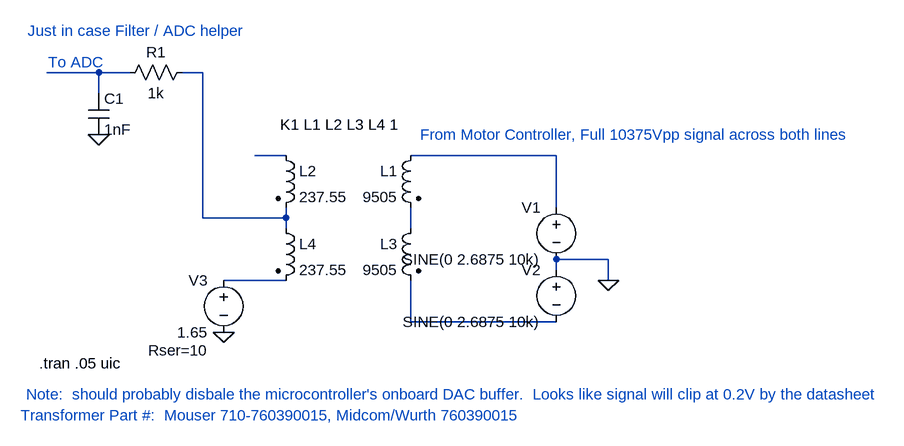
[diagram p0: schematic Input sensing circuit.asc]
Input sensing circuit.asc, the LTspice schematic file:
Version 4
SHEET 1 1576 680
WIRE 80 -144 0 -144
WIRE 128 -144 80 -144
WIRE 240 -144 208 -144
WIRE 80 -112 80 -144
WIRE 368 -16 320 -16
WIRE 784 -16 560 -16
WIRE 784 64 784 -16
WIRE 240 80 240 -144
WIRE 368 80 368 64
WIRE 368 80 240 80
WIRE 368 96 368 80
WIRE 560 96 560 64
WIRE 864 144 784 144
WIRE 784 160 784 144
WIRE 368 176 272 176
WIRE 864 176 864 144
WIRE 560 240 560 176
WIRE 784 240 560 240
FLAG 80 -48 0
FLAG 864 176 0
FLAG 272 256 0
SYMBOL voltage 784 48 M0
WINDOW 123 0 0 Left 2
WINDOW 39 0 0 Left 2
SYMATTR InstName V1
SYMATTR Value SINE(0 2.6875 10k)
SYMBOL ind2 576 -32 M0
SYMATTR InstName L1
SYMATTR Value 9505
SYMATTR Type ind
SYMATTR SpiceLine Rser=0.57
SYMBOL ind2 352 -32 R0
SYMATTR InstName L2
SYMATTR Value 237.55
SYMATTR Type ind
SYMATTR SpiceLine Rser=0.35
SYMBOL ind2 576 80 M0
SYMATTR InstName L3
SYMATTR Value 9505
SYMATTR Type ind
SYMATTR SpiceLine Rser=0.57
SYMBOL ind2 352 80 R0
SYMATTR InstName L4
SYMATTR Value 237.55
SYMATTR Type ind
SYMATTR SpiceLine Rser=0.35
SYMBOL res 224 -160 R90
WINDOW 0 0 56 VBottom 2
WINDOW 3 32 56 VTop 2
SYMATTR InstName R1
SYMATTR Value 1k
SYMBOL cap 64 -112 R0
SYMATTR InstName C1
SYMATTR Value 1nF
SYMBOL voltage 784 144 M0
WINDOW 123 0 0 Left 2
WINDOW 39 0 0 Left 2
SYMATTR InstName V2
SYMATTR Value SINE(0 2.6875 10k)
SYMBOL voltage 272 160 M0
WINDOW 123 0 0 Left 2
WINDOW 39 24 124 Left 2
SYMATTR InstName V3
SYMATTR Value 1.65
SYMATTR SpiceLine Rser=10
TEXT 544 -64 Right 2 !K1 L1 L2 L3 L4 1
TEXT 88 -160 Right 2 ;To ADC
TEXT 1240 -48 Right 2 ;From Motor Controller, Full 10375Vpp signal across both lines
TEXT -12 304 Left 2 !.tran .05 uic
TEXT 304 -208 Right 2 ;Just in case Filter / ADC helper
TEXT -32 352 Left 2 ;Note:  should probably disbale the microcontroller's onboard DAC buffer.  Looks like signal will clip at 0.2V by the datasheet
TEXT -40 384 Left 2 ;Transformer Part #:  Mouser 710-760390015, Midcom/Wurth 760390015

The netlist it stands for:
* Input sensing circuit.asc
V1 N004 0 SINE(0 2.6875 10k)
L1 N004 N005 9505 Rser=0.57
L2 N003 N002 237.55 Rser=0.35
L3 N005 N007 9505 Rser=0.57
L4 N002 N006 237.55 Rser=0.35
R1 N002 N001 1k
C1 N001 0 1nF
V2 0 N007 SINE(0 2.6875 10k)
V3 N006 0 1.65 Rser=10
K1 L1 L2 L3 L4 1
* To ADC
* From Motor Controller, Full 10375Vpp signal across both lines
.tran .05 uic
* Just in case Filter / ADC helper
* Note:  should probably disbale the microcontroller's onboard DAC buffer.  Looks like signal will clip at 0.2V by the datasheet
* Transformer Part #:  Mouser 710-760390015, Midcom/Wurth 760390015
.backanno
.end